# Altium schematic sheet RPC_3V_Schematic.schdoc
size 217 x 116 mm; SheetNumber: 1; SheetTotal: 1
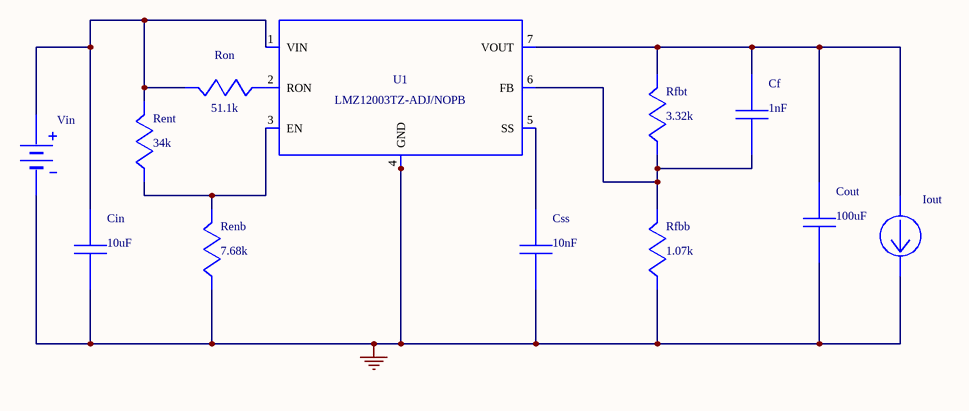
[diagram p0: RPC_3V_Schematic.schdoc]

## Parts
Cf  value 1nF  (hidden comment: GRM1555C1H102JA01J)
Cin  value 10uF  (hidden comment: C2012X6S1C106K085AC)
Cout  value 100uF  (hidden comment: GRM32EC80J107ME20L)
Css  value 10nF  (hidden comment: GRM216R71H103KA01D)
Iout  WB_CURRENT_LOAD  (value not drawn)
Renb  value 7.68k  (hidden comment: ERJ-6ENF7681V)
Rent  value 34k  (hidden comment: ERJ-6ENF3402V)
Rfbb  value 1.07k  (hidden comment: ERJ-6ENF1071V)
Rfbt  value 3.32k  (hidden comment: CRCW08053K32FKEA)
Ron  value 51.1k  (hidden comment: ERJ-6ENF5112V)
U1  LMZ12003TZ-ADJ/NOPB
Vin  WB_BATTERY  (value not drawn)

## Nets
0: Cin.2 Cout.2 Css.2 Iout.2(-) Renb.2 Rfbb.2 U1.4(GND) U1.8(EP) Vin.2(-)
NetCf_1: Cf.1 Cout.1 Iout.1(+) Rfbt.1 U1.7(VOUT)
NetCf_2: Cf.2 Rfbb.1 Rfbt.2 U1.6(FB)
NetCin_1: Cin.1 Rent.1 Ron.1 U1.1(VIN) Vin.1(+)
NetCss_1: Css.1 U1.5(SS)
NetRenb_1: Renb.1 Rent.2 U1.3(EN)
NetRon_2: Ron.2 U1.2(RON)

## Library data of the parts
Cf = GRM1555C1H102JA01J: GRM1555C1H102JA0; Manufacturer Name: MuRata; PackageReference: GRM1555C1H102JA01J; Manufacturer Part Number: GRM1555C1H102JA01J
Cin = C2012X6S1C106K085AC: C2012X6S1C106K08; Manufacturer Name: TDK; PackageReference: C2012X6S1C106K085AC; Manufacturer Part Number: C2012X6S1C106K085AC
Cout = GRM32EC80J107ME20L: GRM32EC80J107ME2; Manufacturer Name: MuRata; PackageReference: GRM32EC80J107ME20L; Manufacturer Part Number: GRM32EC80J107ME20L
Css = GRM216R71H103KA01D: GRM216R71H103KA0; Manufacturer Name: MuRata; PackageReference: GRM216R71H103KA01D; Manufacturer Part Number: GRM216R71H103KA01D
Renb = ERJ-6ENF7681V: Manufacturer Name: Panasonic; PackageReference: ERJ-6ENF7681V; Manufacturer Part Number: ERJ-6ENF7681V
Rent = ERJ-6ENF3402V: Manufacturer Name: Panasonic; PackageReference: ERJ-6ENF3402V; Manufacturer Part Number: ERJ-6ENF3402V
Rfbb = ERJ-6ENF1071V: Manufacturer Name: Panasonic; PackageReference: ERJ-6ENF1071V; Manufacturer Part Number: ERJ-6ENF1071V
Rfbt = CRCW08053K32FKEA: Manufacturer Name: Vishay-Dale; PackageReference: CRCW08053K32FKEA; Manufacturer Part Number: CRCW08053K32FKEA
Ron = ERJ-6ENF5112V: Manufacturer Name: Panasonic; PackageReference: ERJ-6ENF5112V; Manufacturer Part Number: ERJ-6ENF5112V
U1 = LMZ12003TZ-ADJ/NOPB: LMZ12003TZ-ADJ/N; Manufacturer Name: Texas Instruments; PackageReference: LMZ12003TZ-ADJ/NOPB; Manufacturer Part Number: LMZ12003TZ-ADJ/NOPB; Value: N/A
Iout = WB_CURRENT_LOAD: PackageReference: WB_CURRENT_LOAD; Manufacturer Part Number: WB_CURRENT_LOAD; Manufacturer Name: WB_CURRENT_LOAD; Value: N/A
Vin = WB_BATTERY: PackageReference: WB_BATTERY; Manufacturer Part Number: WB_BATTERY; Manufacturer Name: WB_BATTERY; Value: N/A